# Altium schematic sheet ThermostaticBath.SchDoc
size A3
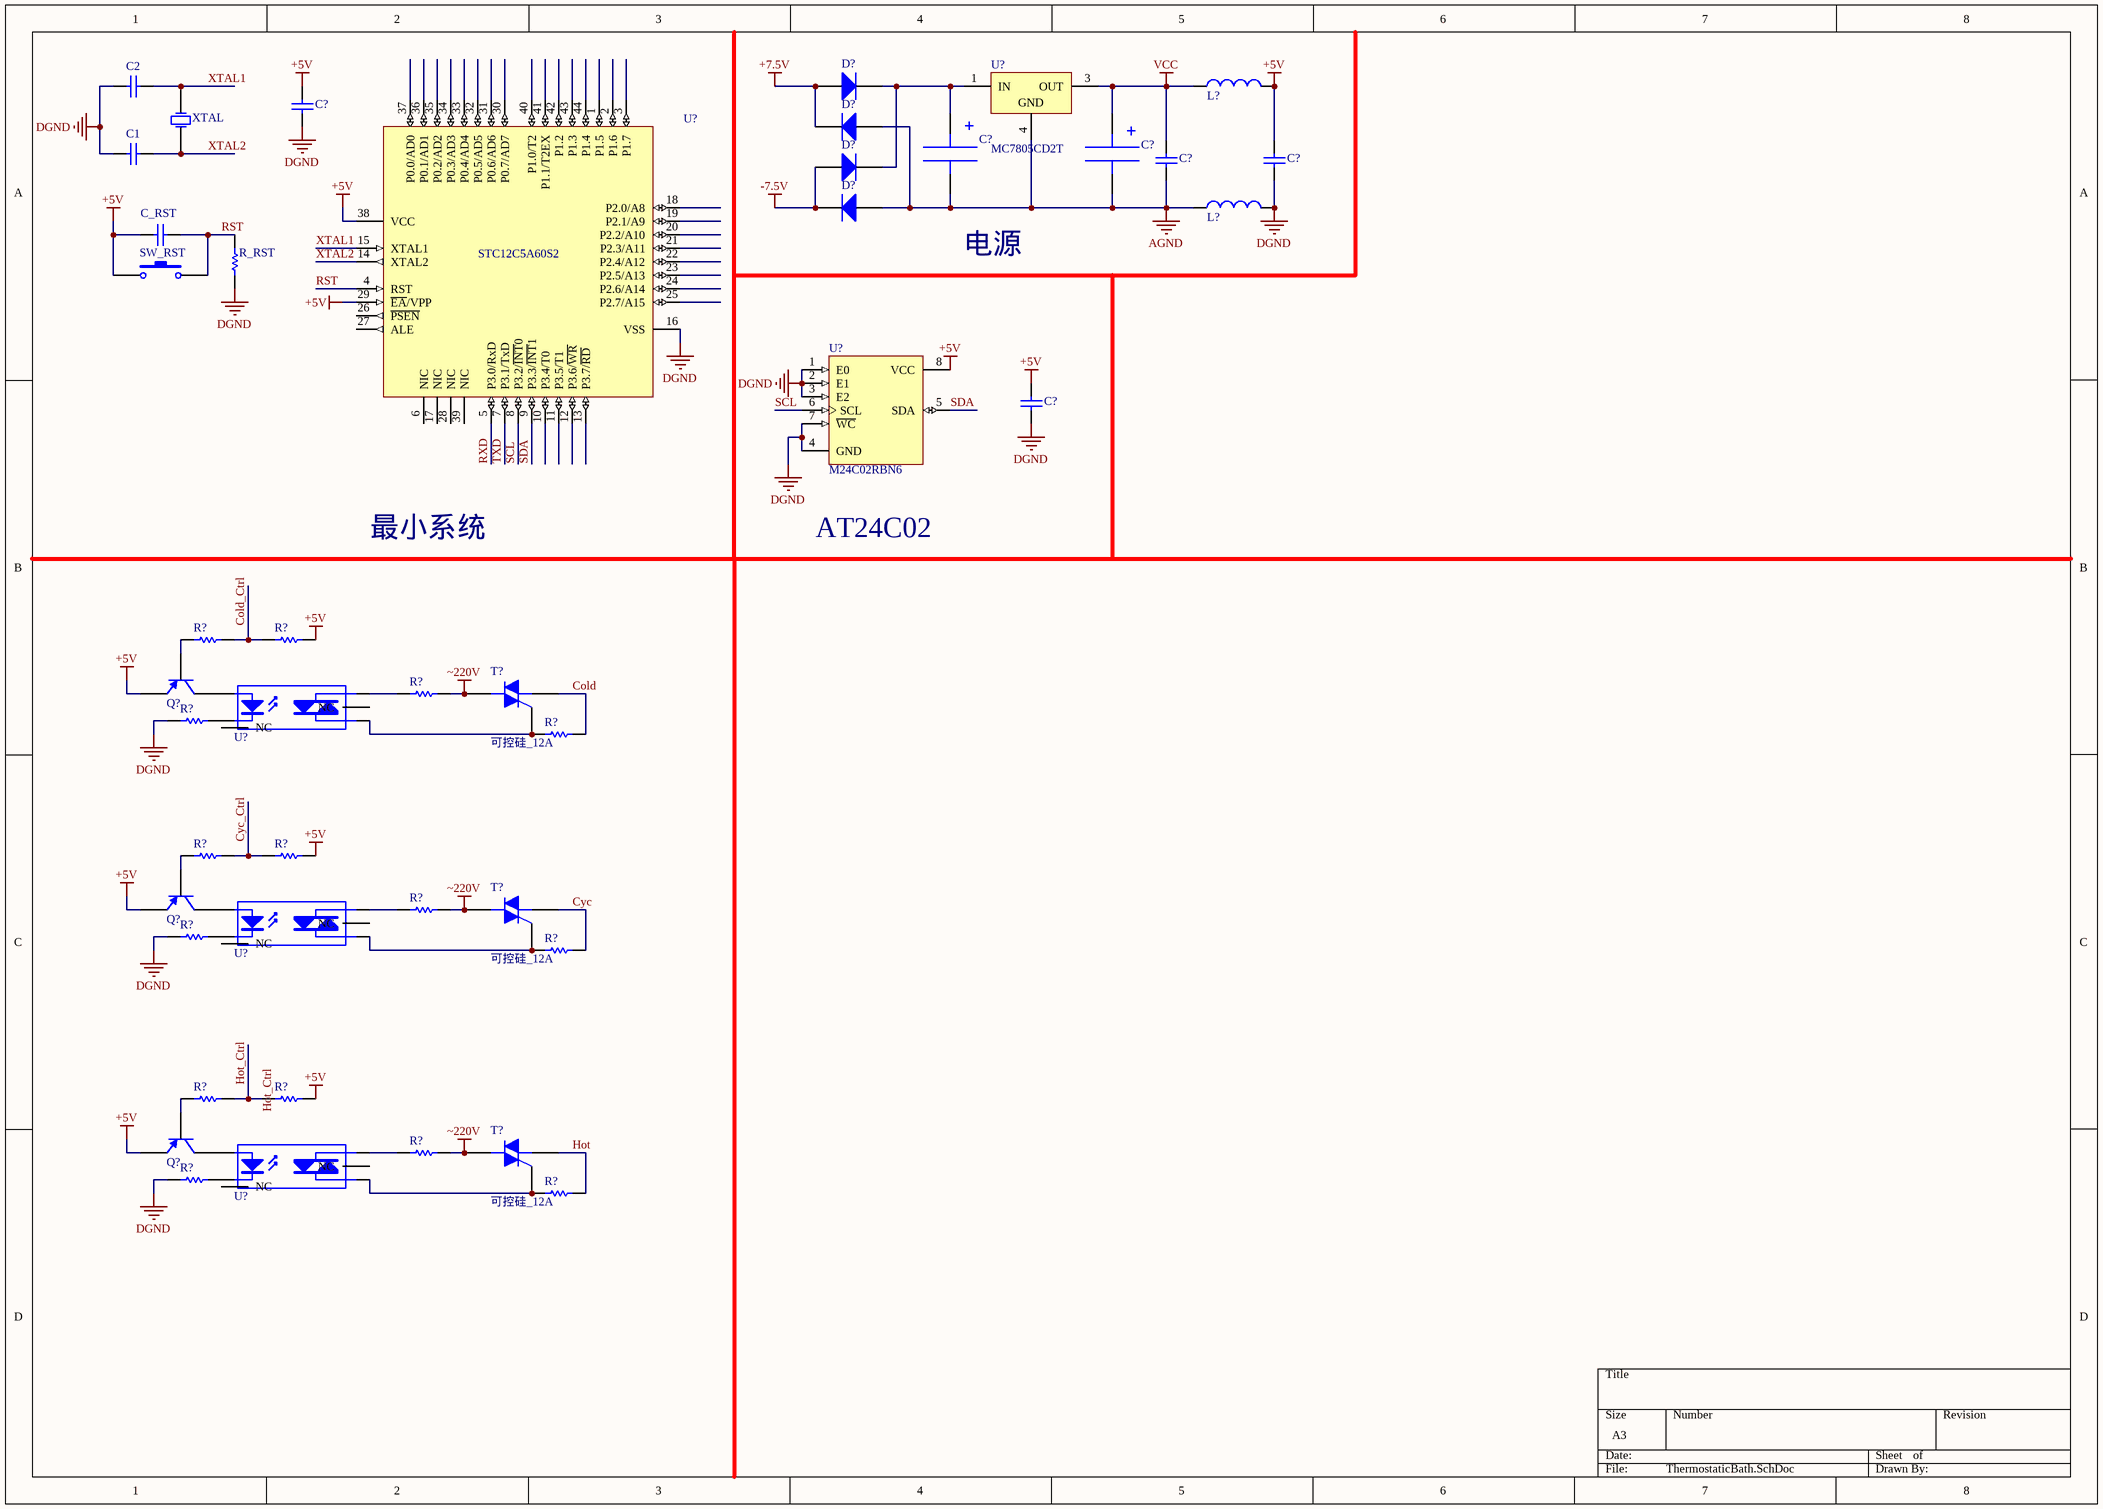
[diagram p0: ThermostaticBath.SchDoc]

## Parts
(Parts that share a designator on the sheet are numbered #1, #2 ... from top to bottom, then left to right.)
C1  Cap Semi  [CAP(0805)]  (value not drawn)
C2  Cap Semi  [CCAP(0805)]  (value not drawn)
C?#1  220UF/16V  [rb.1/.2]  (value not drawn)
C?#2  Cap Semi  [CCAP(0805)]  (value not drawn)
C?#3  4700UF/25V  [rb.3/.6]  (value not drawn)
C?#4  Cap Semi  [CAP(0805)]  (value not drawn)
C?#5  Cap Semi  [CAP(0805)]  (value not drawn)
C?#6  Cap Semi  [CCAP(0805)]  (value not drawn)
C_RST  Cap Semi  [CAP(0805)]  (value not drawn)
D?#1  1N4001  [DO-41]  (value not drawn)
D?#2  1N4001  [DO-41]  (value not drawn)
D?#3  1N4001  [DO-41]  (value not drawn)
D?#4  1N4001  [DO-41]  (value not drawn)
L?#1  10uh/0805/电感  [0805]  (value not drawn)
L?#2  10uh/0805/电感  [0805]  (value not drawn)
Q?#1  9012/三极管  [TO-92A]  (value not drawn)
Q?#2  9012/三极管  [TO-92A]  (value not drawn)
Q?#3  9012/三极管  [TO-92A]  (value not drawn)
R?#1  Res1  [RES(0805)]  (value not drawn)
R?#2  Res1  [RES(0805)]  (value not drawn)
R?#3  Res1  [RES(0805)]  (value not drawn)
R?#4  Res1  [RES(0805)]  (value not drawn)
R?#5  Res1  [RES(0805)]  (value not drawn)
R?#6  Res1  [RES(0805)]  (value not drawn)
R?#7  Res1  [RES(0805)]  (value not drawn)
R?#8  Res1  [RES(0805)]  (value not drawn)
R?#9  Res1  [RES(0805)]  (value not drawn)
R?#10  Res1  [RES(0805)]  (value not drawn)
R?#11  Res1  [RES(0805)]  (value not drawn)
R?#12  Res1  [RES(0805)]  (value not drawn)
R?#13  Res1  [RES(0805)]  (value not drawn)
R?#14  Res1  [RES(0805)]  (value not drawn)
R?#15  Res1  [RES(0805)]  (value not drawn)
R_RST  Res Semi  [RES(0805)]  (value not drawn)
SW_RST  SW-PB  [四脚按键]  (value not drawn)
T?#1  可控硅_12A  [TRIAC_12A]
T?#2  可控硅_12A  [TRIAC_12A]
T?#3  可控硅_12A  [TRIAC_12A]
U?#1  MC7805CD2T  [936-03]
U?#2  M24C02RBN6  [PSDIP8A]
U?#3  STC12C5A60S2  [SOT389-1_L]
U?#4  moc3041  [DIP6]  (value not drawn)
U?#5  moc3041  [DIP6]  (value not drawn)
U?#6  moc3041  [DIP6]  (value not drawn)
XTAL  XTAL  [XTAL]  (value not drawn)

## Nets
+5V: C?#2.2 C?#5.2 C?#6.2 C_RST.1 L?#1.2 Q?#1.1(E) Q?#2.1(E) Q?#3.1(E) R?#2.2 R?#7.2 R?#12.2 SW_RST.1 U?#2.8(VCC) U?#3.29(~{EA}/VPP) U?#3.38(VCC)
+7.5V: D?#1.1(A) D?#2.2(K)
-7.5V: D?#3.1(A) D?#4.2(K)
AGND: C?#1.2 C?#3.2 C?#4.1 D?#2.1(A) D?#4.1(A) L?#2.1 U?#1.4(GND)
DGND: C1.2 C2.2 C?#2.1 C?#5.1 C?#6.1 L?#2.2 R?#4.1 R?#9.1 R?#14.1 R_RST.1 U?#2.1(E0) U?#2.2(E1) U?#2.3(E2) U?#2.4(GND) U?#2.7(~{WC}) U?#3.16(VSS)
VCC: C?#1.1 C?#4.2 L?#1.1 U?#1.3(OUT)
~220V: R?#3.2 R?#8.2 R?#13.2 T?#1.2(M2) T?#2.2(M2) T?#3.2(M2)
Cold: R?#5.2 T?#1.1(M1)
Cold_Ctrl: R?#1.2 R?#2.1
Cyc: R?#10.2 T?#2.1(M1)
Cyc_Ctrl: R?#6.2 R?#7.1
Hot: R?#15.2 T?#3.1(M1)
Hot_Ctrl: R?#11.2 R?#12.1
RST: C_RST.2 R_RST.2 SW_RST.2 U?#3.4(RST)
RXD: U?#3.5(P3.0/RxD)
SCL: U?#2.6(SCL) U?#3.8(P3.2/~{INT}0)
SDA: U?#2.5(SDA) U?#3.9(P3.3/~{INT}1)
TXD: U?#3.7(P3.1/TxD)
XTAL1: C2.1 U?#3.15(XTAL1) XTAL.2
XTAL2: C1.1 U?#3.14(XTAL2) XTAL.1
NetC?#3_1: C?#3.1 D?#1.2(K) D?#3.2(K) U?#1.1(IN)
NetQ?#1_2: Q?#1.2(B) R?#1.1
NetQ?#1_3: Q?#1.3(C) U?#4.1(A)
NetQ?#2_2: Q?#2.2(B) R?#6.1
NetQ?#2_3: Q?#2.3(C) U?#5.1(A)
NetQ?#3_2: Q?#3.2(B) R?#11.1
NetQ?#3_3: Q?#3.3(C) U?#6.1(A)
NetR?#3_1: R?#3.1 U?#4.6(A/K)
NetR?#4_2: R?#4.2 U?#4.2(K)
NetR?#5_1: R?#5.1 T?#1.3(G) U?#4.4(A/K)
NetR?#8_1: R?#8.1 U?#5.6(A/K)
NetR?#9_2: R?#9.2 U?#5.2(K)
NetR?#10_1: R?#10.1 T?#2.3(G) U?#5.4(A/K)
NetR?#13_1: R?#13.1 U?#6.6(A/K)
NetR?#14_2: R?#14.2 U?#6.2(K)
NetR?#15_1: R?#15.1 T?#3.3(G) U?#6.4(A/K)

Not connected (* = marked no-connect by the designer): U?#3 1(P1.5) 2(P1.6) 3(P1.7) 6(NIC) 10(P3.4/T0) 11(P3.5/T1) 12(P3.6/~{WR}) 13(P3.7/~{RD}) 17(NIC) 18(P2.0/A8) 19(P2.1/A9) 20(P2.2/A10) 21(P2.3/A11) 22(P2.4/A12) 23(P2.5/A13) 24(P2.6/A14) 25(P2.7/A15) 26(~{PSEN}) 27(ALE) 28(NIC) 30(P0.7/AD7) 31(P0.6/AD6) 32(P0.5/AD5) 33(P0.4/AD4) 34(P0.3/AD3) 35(P0.2/AD2) 36(P0.1/AD1) 37(P0.0/AD0) 39(NIC) 40(P1.0/T2) 41(P1.1/T2EX) 42(P1.2) 43(P1.3) 44(P1.4); U?#4 3(NC) 5(NC); U?#5 3(NC) 5(NC); U?#6 3(NC) 5(NC)

## Notes on the sheet
- 电源
- 最小系统
- AT24C02
- Labels drawn without touching a wire or pin: Hot_Ctrl

## Library data of the parts
C1 C2 C?#4 C?#5 = Cap Semi: Capacitor (Semiconductor SIM Model); Value: 30pF; Published: 8-Jun-2000; LatestRevisionDate: 17-Jul-2002; LatestRevisionNote: Re-released for DXP Platform.; PackageReference: C1206; Publisher: Altium Limited
C?#1 = cap.1/.2
C?#2 C?#6 = Cap Semi_1: Capacitor (Semiconductor SIM Model); Value: 30pF; Published: 8-Jun-2000; LatestRevisionDate: 17-Jul-2002; LatestRevisionNote: Re-released for DXP Platform.; PackageReference: C1206; Publisher: Altium Limited
C?#3 = cap.3/.6
C_RST = Cap Semi: Capacitor (Semiconductor SIM Model); Value: 10uF; Published: 8-Jun-2000; LatestRevisionDate: 17-Jul-2002; LatestRevisionNote: Re-released for DXP Platform.; PackageReference: C1206; Publisher: Altium Limited
D?#1-D?#4 = Diode 1N4001: 1 Amp General Purpose Rectifier; Published: 8-Jun-2000; LatestRevisionDate: 17-Jul-2002; LatestRevisionNote: Re-released for DXP Platform.; DatasheetDocument: 1998; PackageDocument: Aug-1999; PackageReference: DO-41; Publisher: Altium Limited; Code_JEDEC: DO-204-AL; ComponentLink1Description: Manufacturer Link; ComponentLink1URL: http://www.fairchildsemi.com/; ComponentLink2Description: Datasheet; ComponentLink2URL: http://www.fairchildsemi.com/ds/1N%2F1N4001.pdf
L?#1 L?#2 = inductor
Q?#1-Q?#3 = 2N3906: PNP General Purpose Amplifier; Published: 8-Jun-2000; LatestRevisionDate: 15-Jan-2003; LatestRevisionNote: PCB Footprint 'BCY-W3/D4.7' replaced; DatasheetDocument: 1997; PackageDocument: Sep-1998; PackageReference: TO-92A; Publisher: Altium Limited; Code_JEDEC: TO-92A; ComponentLink1Description: Manufacturer Link; ComponentLink1URL: http://www.fairchildsemi.com/; ComponentLink2Description: Datasheet; ComponentLink2URL: http://www.fairchildsemi.com/ds/2N%2F2N3906.pdf
R?#1-R?#15 = Res1: Resistor; Value: 1K; Published: 8-Jun-2000; LatestRevisionDate: 17-Jul-2002; LatestRevisionNote: Re-released for DXP Platform.; PackageReference: AXIAL-0.3; Publisher: Altium Limited
R_RST = Res Semi: Semiconductor Resistor; Value: 1K; Published: 8-Jun-2000; LatestRevisionDate: 17-Jul-2002; LatestRevisionNote: Re-released for DXP Platform.; PackageReference: AXIAL-0.5; Publisher: Altium Limited
SW_RST = SW-PB: Switch; Published: 24-Mar-1999; LatestRevisionDate: 17-Jul-2002; LatestRevisionNote: Re-released for DXP Platform.; PackageReference: SPST-2; Publisher: Altium Limited
T?#1-T?#3 = TRIAC_12A
U?#1 = MC7805CD2T: Three-Terminal Positive Voltage Regulator; Note: Pin 2 is electrically connected to Pin 4; Pin 2 is trimmed and not drawn;; Published: 15-Apr-2002; DatasheetVersion: 1997; PackageVersion: 1997; PackageReference: 936-03; Publisher: Altium Limited; PackageDescription: D2-PAK/TO-263-AB; 3 Leads (1 Cropped); Body 14.7 (inc. leads) x 10.2 mm (LxW max); ComponentLink1Description: Manufacturer Link; ComponentLink1URL: http://www.onsemi.com/site/products/taxonomy/0,4438,503,00.html; ComponentLink2Description: Datasheet; ComponentLink2URL: http://www.onsemi.com/pub/Collateral/MC7800-D.PDF
U?#2 = M24C02RBN6: 2Kbit Serial I²C Bus EEPROM; Published: 24-Aug-2001; LatestRevisionDate: 06-Jun-2005; LatestRevisionNote: Stylized 3D Model Added.; DatasheetVersion: Sep-1999; PackageVersion: Jun-1998; PackageReference: PSDIP8A; Publisher: Altium Limited; PackageDescription: DIP; 8 Leads; Row Spacing 7.62 mm; Pitch 2.54 mm; ComponentLink1Description: Manufacturer Link; ComponentLink1URL: http://www.st.com/; ComponentLink2Description: Datasheet; ComponentLink2URL: http://www.st.com/stonline/products/literature/ds/5067/m24c01-r.pdf
U?#3 = P89C58X2BBD: 80C51 8-Bit Flash Microcontroller Family, 32 kB Flash; Published: 21-May-2003; LatestRevisionDate: 13-Apr-2006; LatestRevisionNote: IPC-7351 Footprint Added.; DatasheetVersion: 5-Jun-2002; PackageVersion: Jan-2002; PackageReference: SOT389-1; Publisher: Altium Limited; PackageDescription: 44-Pin Thin Quad Flat Pack 0.8 mm Pitch; Code_JEDEC: MO-026; ComponentLink1Description: Manufacturer Link; ComponentLink1URL: http://www-us2.semiconductors.philips.com/; ComponentLink2Description: Datasheet; ComponentLink2URL: http://www.semiconductors.philips.com/acrobat/datasheets/P89C5XX2_2.pdf